# EAGLE schematic microm_schem2 (EAGLE 9.6.2)
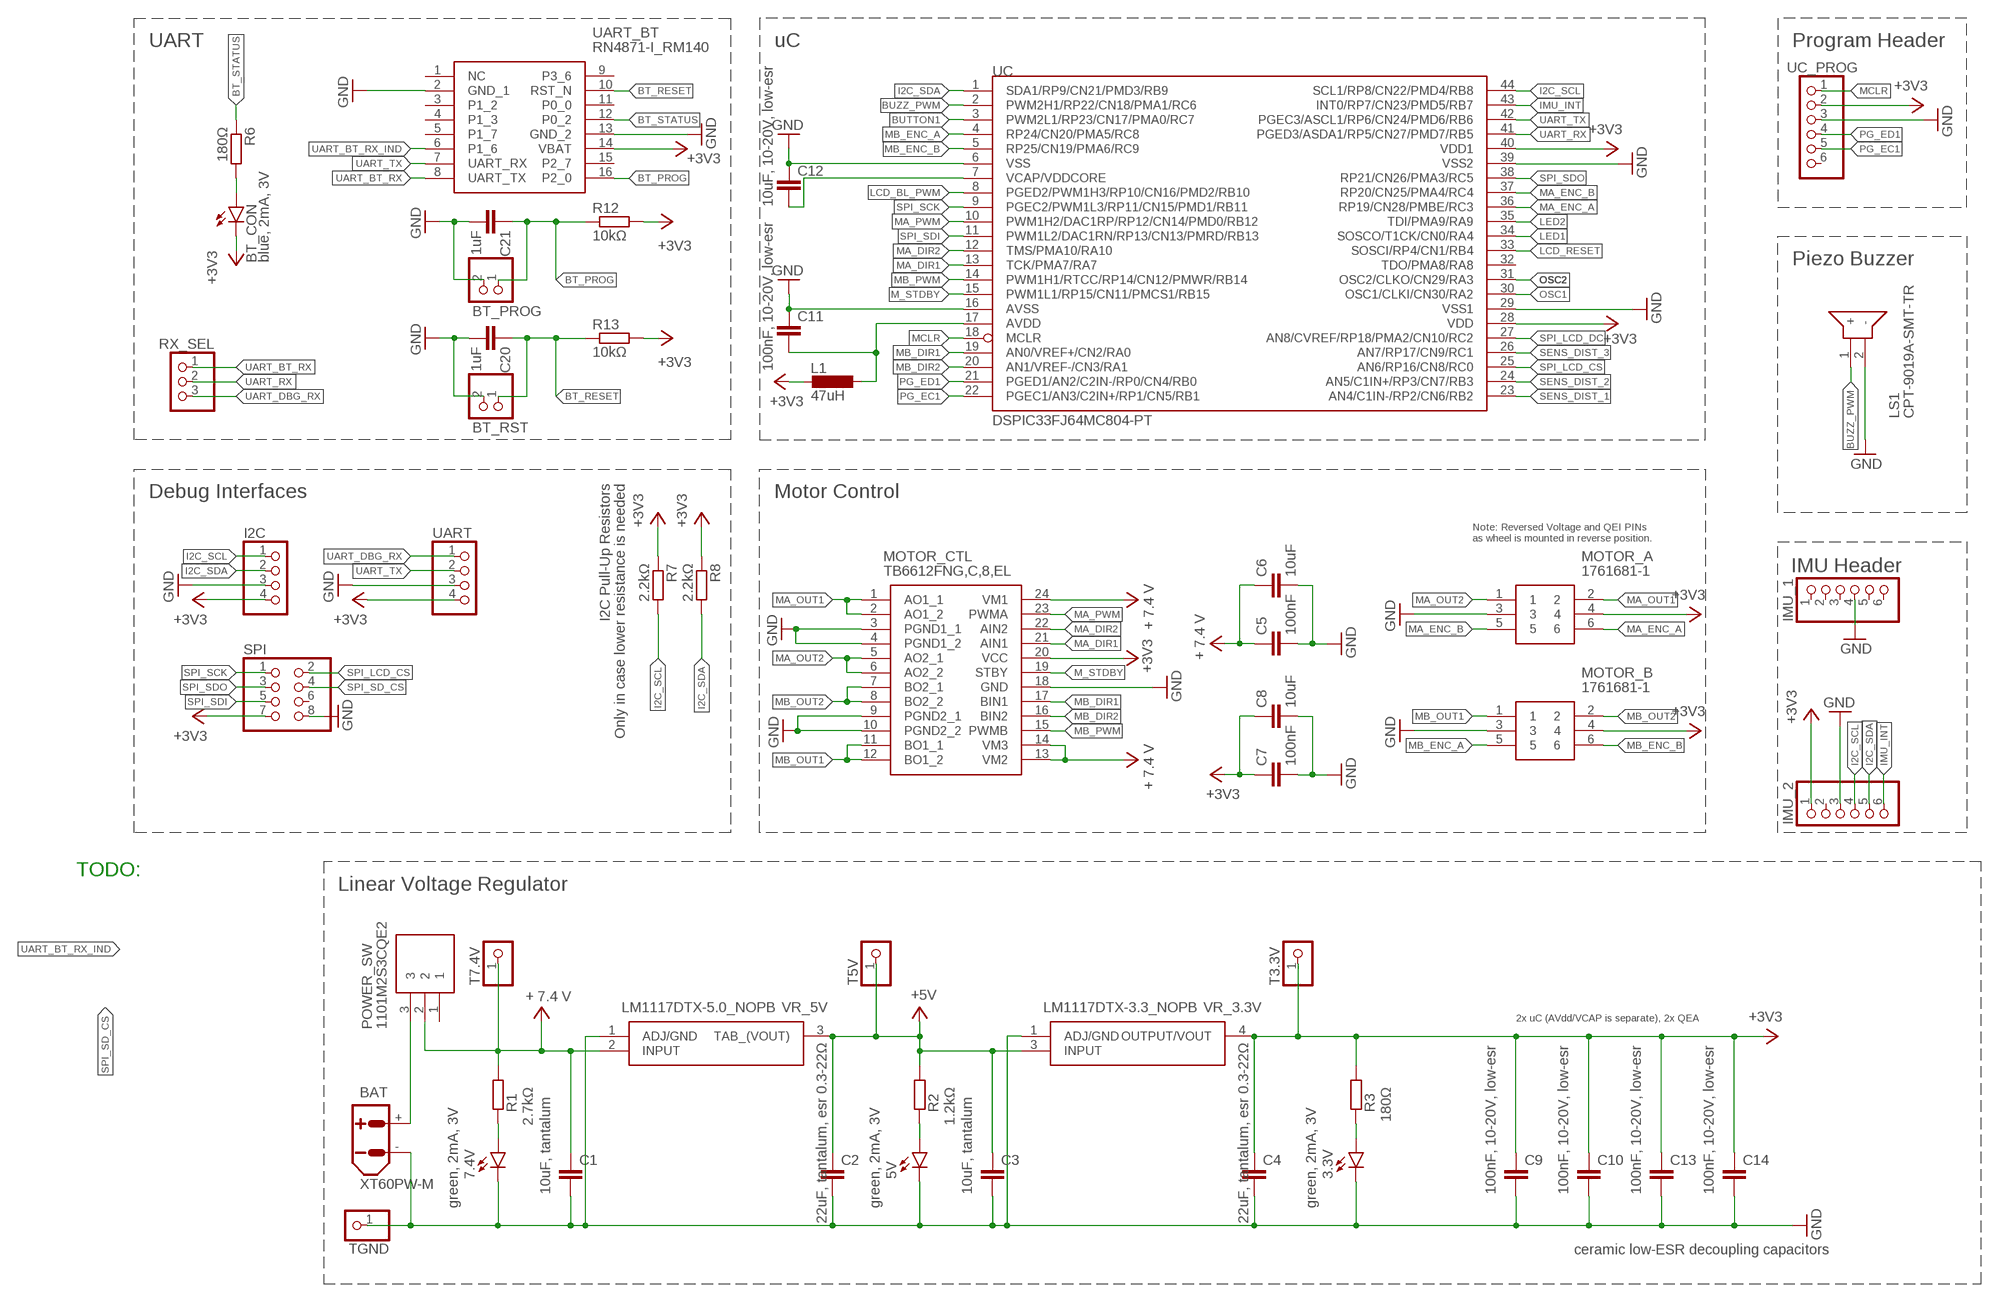
[diagram p0: schematic, sheet 1, part 1 of 2]
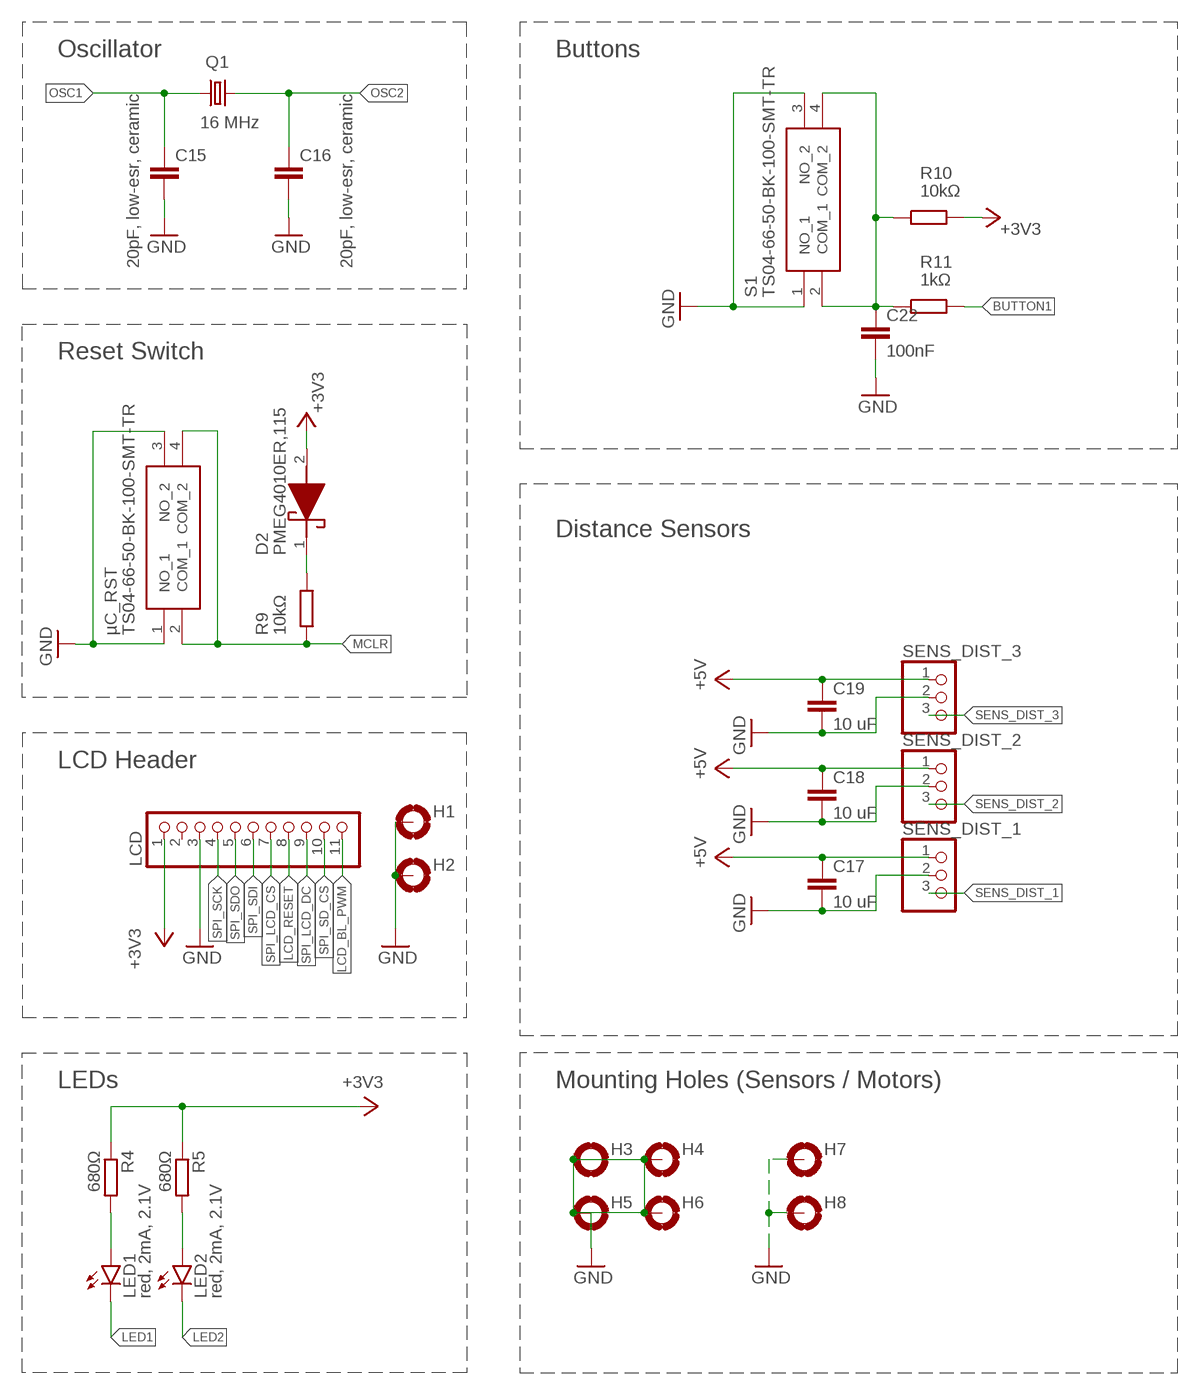
[diagram p1: schematic, sheet 1, part 2 of 2]

## Parts
3.3V  green, 2mA, 3V  LEDCHIP-LED0805  [CHIP-LED0805]
5V  green, 2mA, 3V  LEDCHIP-LED0805  [CHIP-LED0805]
7.4V  green, 2mA, 3V  LEDCHIP-LED0805  [CHIP-LED0805]
BAT  XT60PW-M  [XT60PW-M]
BT_CON  blue, 2mA, 3V  LEDCHIP-LED0805  [CHIP-LED0805]
BT_PROG  PINHD-1X2  [1X02]
BT_RST  PINHD-1X2  [1X02]
C1  10uF, tantalum  C-EUC0805  [C0805]
C2  22uF, tantalum, esr 0.3-22Ω  C-EUC0805  [C0805]
C3  10uF, tantalum  C-EUC0805  [C0805]
C4  22uF, tantalum, esr 0.3-22Ω  C-EUC0805  [C0805]
C5  100nF  C-EUC0805  [C0805]
C6  10uF  C-EUC0805  [C0805]
C7  100nF  C-EUC0805  [C0805]
C8  10uF  C-EUC0805  [C0805]
C9  100nF, 10-20V, low-esr  C-EUC0805  [C0805]
C10  100nF, 10-20V, low-esr  C-EUC0805  [C0805]
C11  100nF, 10-20V, low-esr  C-EUC0805  [C0805]
C12  10uF, 10-20V, low-esr  C-EUC0805  [C0805]
C13  100nF, 10-20V, low-esr  C-EUC0805  [C0805]
C14  100nF, 10-20V, low-esr  C-EUC0805  [C0805]
C15  20pF, low-esr, ceramic  C-EUC0805  [C0805]
C16  20pF, low-esr, ceramic  C-EUC0805  [C0805]
C17  10 uF  C-EUC0805  [C0805]
C18  10 uF  C-EUC0805  [C0805]
C19  10 uF  C-EUC0805  [C0805]
C20  1uF  C-EUC0805  [C0805]
C21  1uF  C-EUC0805  [C0805]
C22  100nF  C-EUC0805  [C0805]
D2  PMEG4010ER,115  [PMEG4010ER115]
H1  MOUNT-PAD-ROUND2.8  [2,8-PAD]
H2  MOUNT-PAD-ROUND2.8  [2,8-PAD]
H3  MOUNT-PAD-ROUND2.8  [2,8-PAD]
H4  MOUNT-PAD-ROUND2.8  [2,8-PAD]
H5  MOUNT-PAD-ROUND2.8  [2,8-PAD]
H6  MOUNT-PAD-ROUND2.8  [2,8-PAD]
H7  MOUNT-PAD-ROUND2.8  [2,8-PAD]
H8  MOUNT-PAD-ROUND2.8  [2,8-PAD]
I2C  PINHD-1X4  [1X04]
IMU_1  PINHD-1X6  [1X06]
IMU_2  PINHD-1X6  [1X06]
L1  47uH  L-EUL1812  [L1812]
LCD  PINHD-1X11  [1X11]
LED1  red, 2mA, 2.1V  LEDCHIPLED_0805  [CHIPLED_0805]
LED2  red, 2mA, 2.1V  LEDCHIPLED_0805  [CHIPLED_0805]
LS1  CPT-9019A-SMT-TR  [CPT9019ASMTTR]
MOTOR_A  1761681-1  [SHDR6W67P254_2X3_1524X916X922P]
MOTOR_B  1761681-1  [SHDR6W67P254_2X3_1524X916X922P]
MOTOR_CTL  TB6612FNG,C,8,EL  [SOP65P760X160-24N]
POWER_SW  1101M2S3CQE2  [1000-SERIES(SPDT)]
Q1  16 MHz  CRYSTALHC49S  [HC49/S]
R1  2.7kΩ  R-EU_R0805  [R0805]
R2  1.2kΩ  R-EU_R0805  [R0805]
R3  180Ω  R-EU_R0805  [R0805]
R4  680Ω  R-EU_R0805  [R0805]
R5  680Ω  R-EU_R0805  [R0805]
R6  180Ω  R-EU_R0805  [R0805]
R7  2.2kΩ  R-EU_R0805  [R0805]
R8  2.2kΩ  R-EU_R0805  [R0805]
R9  10kΩ  R-EU_R0805  [R0805]
R10  10kΩ  R-EU_R0805  [R0805]
R11  1kΩ  R-EU_R0805  [R0805]
R12  10kΩ  R-EU_R0805  [R0805]
R13  10kΩ  R-EU_R0805  [R0805]
RX_SEL  PINHD-1X3  [1X03]
S1  TS04-66-50-BK-100-SMT-TR  [TS046650BK100SMTTR]
SENS_DIST_1  PINHD-1X3  [1X03]
SENS_DIST_2  PINHD-1X3  [1X03]
SENS_DIST_3  PINHD-1X3  [1X03]
SPI  PINHD-2X4  [2X04]
T3.3V  PINHD-1X1  [1X01]
T5V  PINHD-1X1  [1X01]
T7.4V  PINHD-1X1  [1X01]
TGND  PINHD-1X1  [1X01]
UART  PINHD-1X4  [1X04]
UART_BT  RN4871-I_RM140  [RN4871IRM140]
UC  DSPIC33FJ64MC804-PT  [TQFP44]
UC_PROG  PINHD-1X6  [1X06]
VR_3.3V  LM1117DTX-3.3_NOPB  [LM1117DTX33NOPB]
VR_5V  LM1117DTX-5.0_NOPB  [LM78M05CDT]
µC_RST  TS04-66-50-BK-100-SMT-TR  [TS046650BK100SMTTR]

## Nets
+3V3: BT_CON.C C4.1 C7.1 C8.1 C9.1 C10.1 C13.1 C14.1 D2.2(A) I2C.4 IMU_2.1 L1.2 LCD.1 MOTOR_A.4 MOTOR_B.4 MOTOR_CTL.20(VCC) R3.1 R4.1 R5.1 R7.1 R8.1 R10.2 R12.2 R13.2 SPI.7 T3.3V.1 UART.4 UART_BT.14(VBAT) UC.28(VDD) UC.40(VDD1) UC_PROG.2 VR_3.3V.4(OUTPUT/VOUT)
+5V: C2.1 C3.1 C17.1 C18.1 C19.1 R2.1 SENS_DIST_1.1 SENS_DIST_2.1 SENS_DIST_3.1 T5V.1 VR_3.3V.3(INPUT) VR_5V.3(TAB_(VOUT))
+7V4: C1.1 C5.1 C6.1 MOTOR_CTL.13(VM2) MOTOR_CTL.14(VM3) MOTOR_CTL.24(VM1) POWER_SW.2 R1.1 T7.4V.1 VR_5V.2(INPUT) ; supply symbol labelled + 7.4 V
BT_PROG: BT_PROG.1 C21.1 R12.1 UART_BT.16(P2_0)
BT_RESET: BT_RST.1 C20.1 R13.1 UART_BT.10(RST_N)
BT_STATUS: R6.1 UART_BT.12(P0_2)
BUTTON1: R11.2 UC.3(PWM2L1/RP23/CN17/PMA0/RC7)
BUZZ_PWM: LS1.1(+) UC.2(PWM2H1/RP22/CN18/PMA1/RC6)
GND: 3.3V.C 5V.C 7.4V.C BAT.- BT_PROG.2 BT_RST.2 C1.2 C2.2 C3.2 C4.2 C5.2 C6.2 C7.2 C8.2 C9.2 C10.2 C11.1 C12.1 C13.2 C14.2 C15.2 C16.2 C17.2 C18.2 C19.2 C20.2 C21.2 C22.2 H1.B2,8(MOUNT) H2.B2,8(MOUNT) H3.B2,8(MOUNT) H4.B2,8(MOUNT) H5.B2,8(MOUNT) H6.B2,8(MOUNT) H7.B2,8(MOUNT) H8.B2,8(MOUNT) I2C.3 IMU_1.4 IMU_2.3 LCD.3 LS1.2(-) MOTOR_A.3 MOTOR_B.3 MOTOR_CTL.3(PGND1_1) MOTOR_CTL.4(PGND1_2) MOTOR_CTL.9(PGND2_1) MOTOR_CTL.10(PGND2_2) MOTOR_CTL.18(GND) S1.1(NO_1) S1.3(NO_2) SENS_DIST_1.2 SENS_DIST_2.2 SENS_DIST_3.2 SPI.8 TGND.1 UART.3 UART_BT.2(GND_1) UART_BT.13(GND_2) UC.6(VSS) UC.16(AVSS) UC.29(VSS1) UC.39(VSS2) UC_PROG.3 VR_3.3V.1(ADJ/GND) VR_5V.1(ADJ/GND) µC_RST.1(NO_1) µC_RST.3(NO_2)
I2C_SCL: I2C.1 IMU_2.4 R7.2 UC.44(SCL1/RP8/CN22/PMD4/RB8)
I2C_SDA: I2C.2 IMU_2.5 R8.2 UC.1(SDA1/RP9/CN21/PMD3/RB9)
IMU_INT: IMU_2.6 UC.43(INT0/RP7/CN23/PMD5/RB7)
LCD_BL_PWM: LCD.11 UC.8(PGED2/PWM1H3/RP10/CN16/PMD2/RB10)
LCD_RESET: LCD.8 UC.33(SOSCI/RP4/CN1/RB4)
LED1: LED1.C UC.34(SOSCO/T1CK/CN0/RA4)
LED2: LED2.C UC.35(TDI/PMA9/RA9)
M_STDBY: MOTOR_CTL.19(STBY) UC.15(PWM1L1/RP15/CN11/PMCS1/RB15)
MA_DIR1: MOTOR_CTL.21(AIN1) UC.13(TCK/PMA7/RA7)
MA_DIR2: MOTOR_CTL.22(AIN2) UC.12(TMS/PMA10/RA10)
MA_ENC_A: MOTOR_A.6 UC.36(RP19/CN28/PMBE/RC3)
MA_ENC_B: MOTOR_A.5 UC.37(RP20/CN25/PMA4/RC4)
MA_OUT1: MOTOR_A.2 MOTOR_CTL.1(AO1_1) MOTOR_CTL.2(AO1_2)
MA_OUT2: MOTOR_A.1 MOTOR_CTL.5(AO2_1) MOTOR_CTL.6(AO2_2)
MA_PWM: MOTOR_CTL.23(PWMA) UC.10(PWM1H2/DAC1RP/RP12/CN14/PMD0/RB12)
MB_DIR1: MOTOR_CTL.17(BIN1) UC.19(AN0/VREF+/CN2/RA0)
MB_DIR2: MOTOR_CTL.16(BIN2) UC.20(AN1/VREF-/CN3/RA1)
MB_ENC_A: MOTOR_B.5 UC.4(RP24/CN20/PMA5/RC8)
MB_ENC_B: MOTOR_B.6 UC.5(RP25/CN19/PMA6/RC9)
MB_OUT1: MOTOR_B.1 MOTOR_CTL.11(BO1_1) MOTOR_CTL.12(BO1_2)
MB_OUT2: MOTOR_B.2 MOTOR_CTL.7(BO2_1) MOTOR_CTL.8(BO2_2)
MB_PWM: MOTOR_CTL.15(PWMB) UC.14(PWM1H1/RTCC/RP14/CN12/PMWR/RB14)
MCLR: R9.1 UC.18(MCLR) UC_PROG.1 µC_RST.2(COM_1) µC_RST.4(COM_2)
N$1: BT_CON.A R6.2
N$2: BAT.+ POWER_SW.3
N$3: LED1.A R4.2
N$4: 7.4V.A R1.2
N$5: C11.2 L1.1 UC.17(AVDD)
N$6: C22.1 R10.1 R11.1 S1.2(COM_1) S1.4(COM_2)
N$7: D2.1(K) R9.2
N$8: LED2.A R5.2
N$16: 5V.A R2.2
N$17: 3.3V.A R3.2
OSC1: C15.1 Q1.1 UC.30(OSC1/CLKI/CN30/RA2)
OSC2: C16.1 Q1.2 UC.31(OSC2/CLKO/CN29/RA3)
PG_EC1: UC.22(PGEC1/AN3/C2IN+/RP1/CN5/RB1) UC_PROG.5
PG_ED1: UC.21(PGED1/AN2/C2IN-/RP0/CN4/RB0) UC_PROG.4
SENS_DIST_1: SENS_DIST_1.3 UC.23(AN4/C1IN-/RP2/CN6/RB2)
SENS_DIST_2: SENS_DIST_2.3 UC.24(AN5/C1IN+/RP3/CN7/RB3)
SENS_DIST_3: SENS_DIST_3.3 UC.26(AN7/RP17/CN9/RC1)
SPI_LCD_CS: LCD.7 SPI.2 UC.25(AN6/RP16/CN8/RC0)
SPI_LCD_DC: LCD.9 UC.27(AN8/CVREF/RP18/PMA2/CN10/RC2)
SPI_SCK: LCD.4 SPI.1 UC.9(PGEC2/PWM1L3/RP11/CN15/PMD1/RB11)
SPI_SD_CS: LCD.10 SPI.4
SPI_SDI: LCD.6 SPI.5 UC.11(PWM1L2/DAC1RN/RP13/CN13/PMRD/RB13)
SPI_SDO: LCD.5 SPI.3 UC.38(RP21/CN26/PMA3/RC5)
UART_BT_RX: RX_SEL.1 UART_BT.8(UART_TX)
UART_BT_RX_IND: UART_BT.6(P1_6)
UART_DBG_RX: RX_SEL.3 UART.1
UART_RX: RX_SEL.2 UC.41(PGED3/ASDA1/RP5/CN27/PMD7/RB5)
UART_TX: UART.2 UART_BT.7(UART_RX) UC.42(PGEC3/ASCL1/RP6/CN24/PMD6/RB6)
VCAP/VDDCORE: C12.2 UC.7(VCAP/VDDCORE)
Unconnected: IMU_1.1 IMU_1.2 IMU_1.3 IMU_1.5 IMU_1.6 IMU_2.2 LCD.2 POWER_SW.1 SPI.6 UART_BT.1(NC) UART_BT.3(P1_2) UART_BT.4(P1_3) UART_BT.5(P1_7) UART_BT.9(P3_6) UART_BT.11(P0_0) UART_BT.15(P2_7) UC.32(TDO/PMA8/RA8) UC_PROG.6

## Notes on the sheet
- UART | uC | Program Header | Oscillator | Buttons
- Piezo Buzzer
- Reset Switch
- Distance Sensors
- I2C Pull-Up Resistors
  Only in case lower resistance is needed
- Debug Interfaces | Motor Control
- Note: Reversed Voltage and QEI PINs 
  as wheel is mounted in reverse position.
- IMU Header
- LCD Header
- TODO:
- Linear Voltage Regulator | LEDs | Mounting Holes (Sensors / Motors)
- 2x uC (AVdd/VCAP is separate), 2x QEA
- ceramic low-ESR decoupling capacitors

## Library data of the parts
3.3V 5V 7.4V BT_CON LED1 LED2 = led:LED: LED OSRAM: - CHIPLED LG R971, LG N971, LY N971, LG Q971, LY Q971, LO R971, LY R971 LH N974, LH R974 LS Q976, LO Q976, LY Q976 LO Q996 - Hyper CHIPLED LW Q18S LB Q993, LB Q99A, LB R99A - SideLED LS A670, LO A670, LY A670, LG A670, LP A670 LB A673, LV A673, LT A673, LW A673 LH A674 LY A675 LS A676, LA A676, LO A676, LY A676, LW A676 LS A679, LY A679, LG A679 - Hyper Micro SIDELED® LS Y876, LA Y876, LO Y876, LY Y876 LT Y87S - SmartLED LW L88C, LW L88S LB L89C, LB L89S, LG L890 LS L89K, LO L89K, LY L89K LS L896, LA L896, LO L896, LY L896 - TOPLED LS T670, LO T670, LY T670, LG T670, LP T670 LSG T670, LSP T670, LSY T670, LOP T670, LYG T670 LG T671, LOG T671, LSG T671 LB T673, LV T673, LT T673, LW T673 LH T674 LS T676, LA T676, LO T676, LY T676, LB T676, LH T676, LSB T676, LW T676 LB T67C, LV T67C, LT T67C, LS T67K, LO T67K, LY T67K, LW E67C LS E67B, LA E67B, LO E67B, LY E67B, LB E67C, LV E67C, LT E67C LW T67C LS T679, LY T679, LG T679 LS T770, LO T770, LY T770, LG T770, LP T770 LB T773, LV T773, LT T773, LW T773 LH T774 LS E675, LA E675, LY E675, LS T675 LS T776, LA T776, LO T776, LY T776, LB T776 LHGB T686 LT T68C, LB T68C - Hyper Mini TOPLED® LB M676 - Mini TOPLED Santana® LG M470 LS M47K, LO M47K, LY M47K Source: http://www.osram.convergy.de LUXEON: - LUMILED® LXK2-PW12-R00, LXK2-PW12-S00, LXK2-PW14-U00, LXK2-PW14-V00 LXK2-PM12-R00, LXK2-PM12-S00, LXK2-PM14-U00 LXK2-PE12-Q00, LXK2-PE12-R00, LXK2-PE12-S00, LXK2-PE14-T00, LXK2-PE14-U00 LXK2-PB12-K00, LXK2-PB12-L00, LXK2-PB12-M00, LXK2-PB14-N00, LXK2-PB14-P00, LXK2-PB14-Q00 LXK2-PR12-L00, LXK2-PR12-M00, LXK2-PR14-Q00, LXK2-PR14-R00 LXK2-PD12-Q00, LXK2-PD12-R00, LXK2-PD12-S00 LXK2-PH12-R00, LXK2-PH12-S00 LXK2-PL12-P00, LXK2-PL12-Q00, LXK2-PL12-R00 Source: www.luxeon.com KINGBRIGHT: KA-3528ASYC Source: www.kingbright.com
BAT = amass:XT60: AMASS XT60 connector Store in Japan AMASS XT60 connector <https://szc.jp/ams-xt60>
BT_PROG BT_RST = pinhead:PINHD-1X2: PIN HEADER
C1-C22 = rcl:C-EU: CAPACITOR, European symbol; SPICEPREFIX: C
D2 = SamacSys_Parts:PMEG4010ER,115: Nexperia 40V 1A, Diode, 2-Pin SOD-123 PMEG4010ER,115 Source: Datasheet <https://assets.nexperia.com/documents/data-sheet/PMEG4010ER.pdf>; DESCRIPTION: Nexperia 40V 1A, Diode, 2-Pin SOD-123 PMEG4010ER,115; HEIGHT: 1.1mm; MANUFACTURER_NAME: Nexperia; MANUFACTURER_PART_NUMBER: PMEG4010ER,115; MOUSER_PART_NUMBER: 771-PMEG4010ER115; MOUSER_PRICE-STOCK: https://www.mouser.co.uk/ProductDetail/Nexperia/PMEG4010ER115?qs=LMSg3oBIm%2FgUK9jNVC9MaQ%3D%3D
H1-H8 = holes:MOUNT-PAD-ROUND: MOUNTING PAD, round
I2C UART = pinhead:PINHD-1X4: PIN HEADER
IMU_1 IMU_2 UC_PROG = pinhead:PINHD-1X6: PIN HEADER
L1 = rcl:L-EU: INDUCTOR, European symbol; SPICEPREFIX: L
LCD = pinhead:PINHD-1X11: PIN HEADER
LS1 = SamacSys_Parts:CPT-9019A-SMT-TR: 9 mm, 25 Vp-p Vdc, 75 dB, Surface Mount (SMT), Piezo Audio Transducer Buzzer Source: Datasheet <https://www.sameskydevices.com/product/resource/supplyframepdf/cpt-9019a-smt-tr.pdf>; ARROW_PART_NUMBER: CPT-9019A-SMT-TR; ARROW_PRICE-STOCK: https://www.arrow.com/en/products/cpt-9019a-smt-tr/same-sky-(formerly-cui-devices)?utm_currency=USD&region=nac; DESCRIPTION: 9 mm, 25 Vp-p Vdc, 75 dB, Surface Mount (SMT), Piezo Audio Transducer Buzzer; HEIGHT: 2.1mm; MANUFACTURER_NAME: Same Sky; MANUFACTURER_PART_NUMBER: CPT-9019A-SMT-TR; MOUSER_PART_NUMBER: 179-CPT-9019A-SMT-TR; MOUSER_PRICE-STOCK: https://www.mouser.co.uk/ProductDetail/Same-Sky/CPT-9019A-SMT-TR?qs=3Rah4i%252BhyCH9W9p08uaaRg%3D%3D
MOTOR_A MOTOR_B = SamacSys_Parts:1761681-1: Body Features: Primary Product Color Black | Connector Profile Low | Daisy Chain With | Configuration Features: PCB Mount Orientation Vertical | Number of Positions 6 | Number of Rows 2 | Contact Features: Contact Mating Area Plating Material Thickness 15 MICIN | Contact Type Pin | PCB Contact Termination Area Plating Material Tin | Contact Base Material Phosphor Bronze | PCB Contact Termination Area Plating Material Thickness 100 MICIN | Contact Current Rating (Max) 1 AMP | Contact Underplating Material Ni Source: Datasheet <https://www.te.com/commerce/DocumentDelivery/DDEController?Action=showdoc&DocId=Customer Drawing1761681A1pdfEnglishENG_CD_1761681_A1.pdf1761681-1>; DESCRIPTION: Body Features: Primary Product Color Black | Connector Profile Low | Daisy Chain With | Configuration Features: PCB Mount Orientation Vertical | Number of Positions 6 | Number of Rows 2 | Contact Features: Contact Mating Area Plating Material Thickness 15 MICIN | Contact Type Pin | PCB Contact Termination Area Plating Material Tin | Contact Base Material Phosphor Bronze | PCB Contact Termination Area Plating Material Thickness 100 MICIN | Contact Current Rating (Max) 1 AMP | Contact Underplating Material Ni; HEIGHT: 9.22mm; MANUFACTURER_NAME: TE Connectivity; MANUFACTURER_PART_NUMBER: 1761681-1; MOUSER_PART_NUMBER: 571-1761681-1; MOUSER_PRICE-STOCK: https://www.mouser.co.uk/ProductDetail/TE-Connectivity/1761681-1?qs=BqFpTYCQ3dLAeZ2wzdz7aw%3D%3D
MOTOR_CTL = SamacSys_Parts:TB6612FNG,C,8,EL: otor / Motion / Ignition Controllers & Drivers Brush Motor Driver IC Source: Datasheet <http://toshiba.semicon-storage.com/info/docget.jsp?did=10660&prodName=TB6612FNG>; DESCRIPTION: otor / Motion / Ignition Controllers & Drivers Brush Motor Driver IC; HEIGHT: 1.6mm; MANUFACTURER_NAME: Toshiba; MANUFACTURER_PART_NUMBER: TB6612FNG,C,8,EL; MOUSER_PART_NUMBER: 757-TB6612FNGC8EL; MOUSER_PRICE-STOCK: https://www.mouser.co.uk/ProductDetail/Toshiba/TB6612FNGC8EL?qs=rsevcuukUAy2UalRuv4E%2FQ%3D%3D
POWER_SW = SamacSys_Parts:1101M2S3CQE2: 1101M2S3CQE2 (Slide Switches) Source: Datasheet <https://www.ckswitches.com/media/1429/1000.pdf>; ARROW_PART_NUMBER: 1101M2S3CQE2; ARROW_PRICE-STOCK: https://www.arrow.com/en/products/1101m2s3cqe2/ck?utm_currency=USD&region=europe; DESCRIPTION: 1101M2S3CQE2 (Slide Switches); HEIGHT: mm; MANUFACTURER_NAME: C & K COMPONENTS; MANUFACTURER_PART_NUMBER: 1101M2S3CQE2; MOUSER_PART_NUMBER: 611-1101M2S3CQE2; MOUSER_PRICE-STOCK: https://www.mouser.co.uk/ProductDetail/CK/1101M2S3CQE2?qs=C4UUOezh8MStnZqkTHGAfQ%3D%3D
Q1 = crystal:CRYSTAL: CRYSTAL; OC_FARNELL: 1667008; OC_NEWARK: unknown
R1-R13 = rcl:R-EU_: RESISTOR, European symbol; SPICEPREFIX: R
RX_SEL SENS_DIST_1-SENS_DIST_3 = pinhead:PINHD-1X3: PIN HEADER
S1 µC_RST = SamacSys_Parts:TS04-66-50-BK-100-SMT-TR: 6 x 6 mm, 9.5 mm Actuator Height, 160 gf, Black, Surface Mount, SPST, Tactile Switch Source: Datasheet <https://www.sameskydevices.com/product/resource/supplyframepdf/ts04.pdf>; DESCRIPTION: 6 x 6 mm, 5 mm Actuator Height, 160 gf, Black, Surface Mount, SPST, Tactile Switch; HEIGHT: 5mm; MANUFACTURER_NAME: Same Sky; MANUFACTURER_PART_NUMBER: TS04-66-95-BK-160-SMT-TR; MOUSER_PART_NUMBER: 179-TS046695BK160SMR; MOUSER_PRICE-STOCK: https://www.mouser.co.uk/ProductDetail/Same-Sky/TS04-66-95-BK-160-SMT-TR?qs=VJzv269c%252BPZ4T0IrjAQJjg%3D%3D
SPI = pinhead:PINHD-2X4: PIN HEADER
T3.3V T5V T7.4V TGND = pinhead:PINHD-1X1: PIN HEADER
UART_BT = SamacSys_Parts:RN4871-I_RM140: Bluetooth Modules (802.15.1) Bluetooth Low Energy BLE Module, Shielded, Antenna, ASCII Interface, 9x11.5mm Source: Datasheet <https://ww1.microchip.com/downloads/aemDocuments/documents/WSG/ProductDocuments/DataSheets/RN4870-71-Bluetooth-Low-Energy-Module-DS50002489.pdf>; ARROW_PART_NUMBER: RN4871-I/RM140; ARROW_PRICE-STOCK: https://www.arrow.com/en/products/rn4871-irm140/microchip-technology?utm_currency=USD&region=nac; DESCRIPTION: Bluetooth Modules (802.15.1) Bluetooth Low Energy BLE Module, Shielded, Antenna, ASCII Interface, 9x11.5mm; HEIGHT: 2.1mm; MANUFACTURER_NAME: Microchip; MANUFACTURER_PART_NUMBER: RN4871-I/RM140; MOUSER_PART_NUMBER: 579-RN4871-I/RM140; MOUSER_PRICE-STOCK: https://www.mouser.co.uk/ProductDetail/Microchip-Technology/RN4871-I-RM140?qs=BJlw7L4Cy79OHrwBC2yoPQ%3D%3D
UC = microchip-dspic33fjxxmc:DSPIC33FJ64MC804: dsPIC33FJ32MC302/304, dsPIC33FJ64MCX02/X04, AND dsPIC33FJ128MCX02/X04 High-Performance, 16-bit Digital Signal Controllers Package:44 Pin TQFP Operating Range: * Up to 40 MIPS operation (at 3.0V -3.6V): - Industrial temperature range (-40°C to +85°C) - Extended temperature range (-40°C to +125°C) High-Performance DSC CPU: * Modified Harvard architecture * C compiler optimized instruction set * 16-bit wide data path * 24-bit wide instructions * Linear program memory addressing up to 4M instruction words * Linear data memory addressing up to 64 Kbytes * 83 base instructions: mostly 1 word/1 cycle * Two 40-bit accumulators with rounding and saturation options * Flexible and powerful addressing modes: - Indirect - Modulo - Bit-Reversed * Software stack * 16 x 16 fractional/integer multiply operations * 32/16 and 16/16 divide operations * Single-cycle multiply and accumulate: - Accumulator write back for DSP operations - Dual data fetch * Up to ±16-bit shifts for up to 40-bit data Direct Memory Access (DMA): * 8-channel hardware DMA * Up to 2 Kbytes dual ported DMA buffer area (DMA RAM) to store data transferred via DMA: - Allows data transfer between RAM and a peripheral while CPU is executing code (no cycle stealing) * Most peripherals support DMA Timers/Capture/Compare/PWM: * Timer/Counters, up to five 16-bit timers: - Can pair up to make two 32-bit timers - One timer runs as a Real-Time Clock with an external 32.768 kHz oscillator - Programmable prescaler * Input Capture (up to four channels): - Capture on up, down or both edges - 16-bit capture input functions - 4-deep FIFO on each capture * Output Compare (up to four channels): - Single or Dual 16-bit Compare mode - 16-bit Glitchless PWM mode * Hardware Real-Time Clock/Calendar (RTCC): - Provides clock, calendar, and alarm functions Interrupt Controller: * 5-cycle latency * Up to 53 available interrupt sources * Up to three external interrupts * Seven programmable priority levels * Five processor exceptions Digital I/O: * Peripheral pin Select functionality * Up to 35 programmable digital I/O pins * Wake-up/Interrupt-on-Change for up to 31 pins * Output pins can drive from 3.0V to 3.6V * Up to 5V output with open drain configuration * All digital input pins are 5V tolerant * 4 mA sink on all I/O pins On-Chip Flash and SRAM: * Flash program memory (up to 128 Kbytes) * Data SRAM (up to 16 Kbytes) * Boot, Secure, and General Security for program Flash System Management: * Flexible clock options: - External, crystal, resonator, internal RC - Fully integrated Phase-Locked Loop (PLL) - Extremely low jitter PLL * Power-up Timer * Oscillator Start-up Timer/Stabilizer * Watchdog Timer with its own RC oscillator * Fail-Safe Clock Monitor * Reset by multiple sources Power Management: * On-chip 2.5V voltage regulator * Switch between clock sources in real time * Idle, Sleep, and Doze modes with fast wake-up Analog-to-Digital Converters (ADCs): * 10-bit, 1.1 Msps or 12-bit, 500 Ksps conversion: - Two and four simultaneous samples (10-bit ADC) - Up to nine input channels with auto-scanning - Conversion start can be manual or synchronized with one of four trigger sources - Conversion possible in Sleep mode - ±2 LSb max integral nonlinearity - ±1 LSb max differential nonlinearity Audio Digital-to-Analog Converter (DAC): - 16-bit Dual Channel DAC module - 100 Ksps maximum sampling rate - Second-Order Digital Delta-Sigma Modulator Comparator Module: * Two analog comparators with programmable input/output configuration CMOS Flash Technology: * Low-power, high-speed Flash technology * Fully static design * 3.3V (±10%) operating voltage * Industrial and Extended temperature * Low power consumption Motor Control Peripherals: * 6-channel 16-bit Motor Control PWM: - Three duty cycle generators - Independent or Complementary mode - Programmable dead-time and output polarity - Edge-aligned or center-aligned - Manual output override control - One Fault input - Trigger for ADC conversions - PWM frequency for 16-bit resolution (@ 40 MIPS) = 1220 Hz for Edge-Aligned mode, 610 Hz for Center-Aligned mode - PWM frequency for 11-bit resolution (@ 40 MIPS) = 39.1 kHz for Edge-Aligned mode, 19.55 kHz for Center-Aligned mode * 2-channel 16-bit Motor Control PWM: - One duty cycle generator - Independent or Complementary mode - Programmable dead time and output polarity - Edge-aligned or center-aligned - Manual output override control - One Fault input - Trigger for ADC conversions - PWM frequency for 16-bit resolution (@ 40 MIPS) = 1220 Hz for Edge-Aligned mode, 610 Hz for Center-Aligned mode - PWM frequency for 11-bit resolution (@ 40 MIPS) = 39.1 kHz for Edge-Aligned mode, 19.55 kHz for Center-Aligned mode * 2-Quadrature Encoder Interface module: - Phase A, Phase B, and index pulse input - 16-bit up/down position counter - Count direction status - Position Measurement (x2 and x4) mode - Programmable digital noise filters on inputs - Alternate 16-bit Timer/Counter mode - Interrupt on position counter rollover/underflow
VR_3.3V = SamacSys_Parts:LM1117DTX-3.3_NOPB: Space saving 800-mA low-dropout linear regulator with internal current limit Source: Datasheet <http://www.ti.com/lit/gpn/lm1117>; ARROW_PART_NUMBER: LM1117DTX-3.3/NOPB; ARROW_PRICE-STOCK: https://www.arrow.com/en/products/lm1117dtx-3.3nopb/texas-instruments?utm_currency=USD&region=nac; DESCRIPTION: Space saving 800-mA low-dropout linear regulator with internal current limit; HEIGHT: mm; MANUFACTURER_NAME: Texas Instruments; MANUFACTURER_PART_NUMBER: LM1117DTX-3.3/NOPB; MOUSER_PART_NUMBER: 926-LM1117DTX3.3NOPB; MOUSER_PRICE-STOCK: https://www.mouser.co.uk/ProductDetail/Texas-Instruments/LM1117DTX-3.3-NOPB?qs=X1J7HmVL2ZFMDtR97FJi7A%3D%3D
VR_5V = SamacSys_Parts:LM1117DTX-5.0_NOPB: Space saving 800-mA low-dropout linear regulator with internal current limit Source: Datasheet <http://www.ti.com/lit/gpn/lm1117>; ARROW_PART_NUMBER: LM1117DTX-5.0/NOPB; ARROW_PRICE-STOCK: https://www.arrow.com/en/products/lm1117dtx-5.0nopb/texas-instruments?utm_currency=USD&region=nac; DESCRIPTION: Space saving 800-mA low-dropout linear regulator with internal current limit; HEIGHT: mm; MANUFACTURER_NAME: Texas Instruments; MANUFACTURER_PART_NUMBER: LM1117DTX-5.0/NOPB; MOUSER_PART_NUMBER: 926-LM1117DTX50NOPB; MOUSER_PRICE-STOCK: https://www.mouser.co.uk/ProductDetail/Texas-Instruments/LM1117DTX-5.0-NOPB?qs=X1J7HmVL2ZGetRa19U64lA%3D%3D